# Altium schematic sheet AD8065_circuit.SchDoc
size A4; SheetNumber: 1; SheetTotal: 1
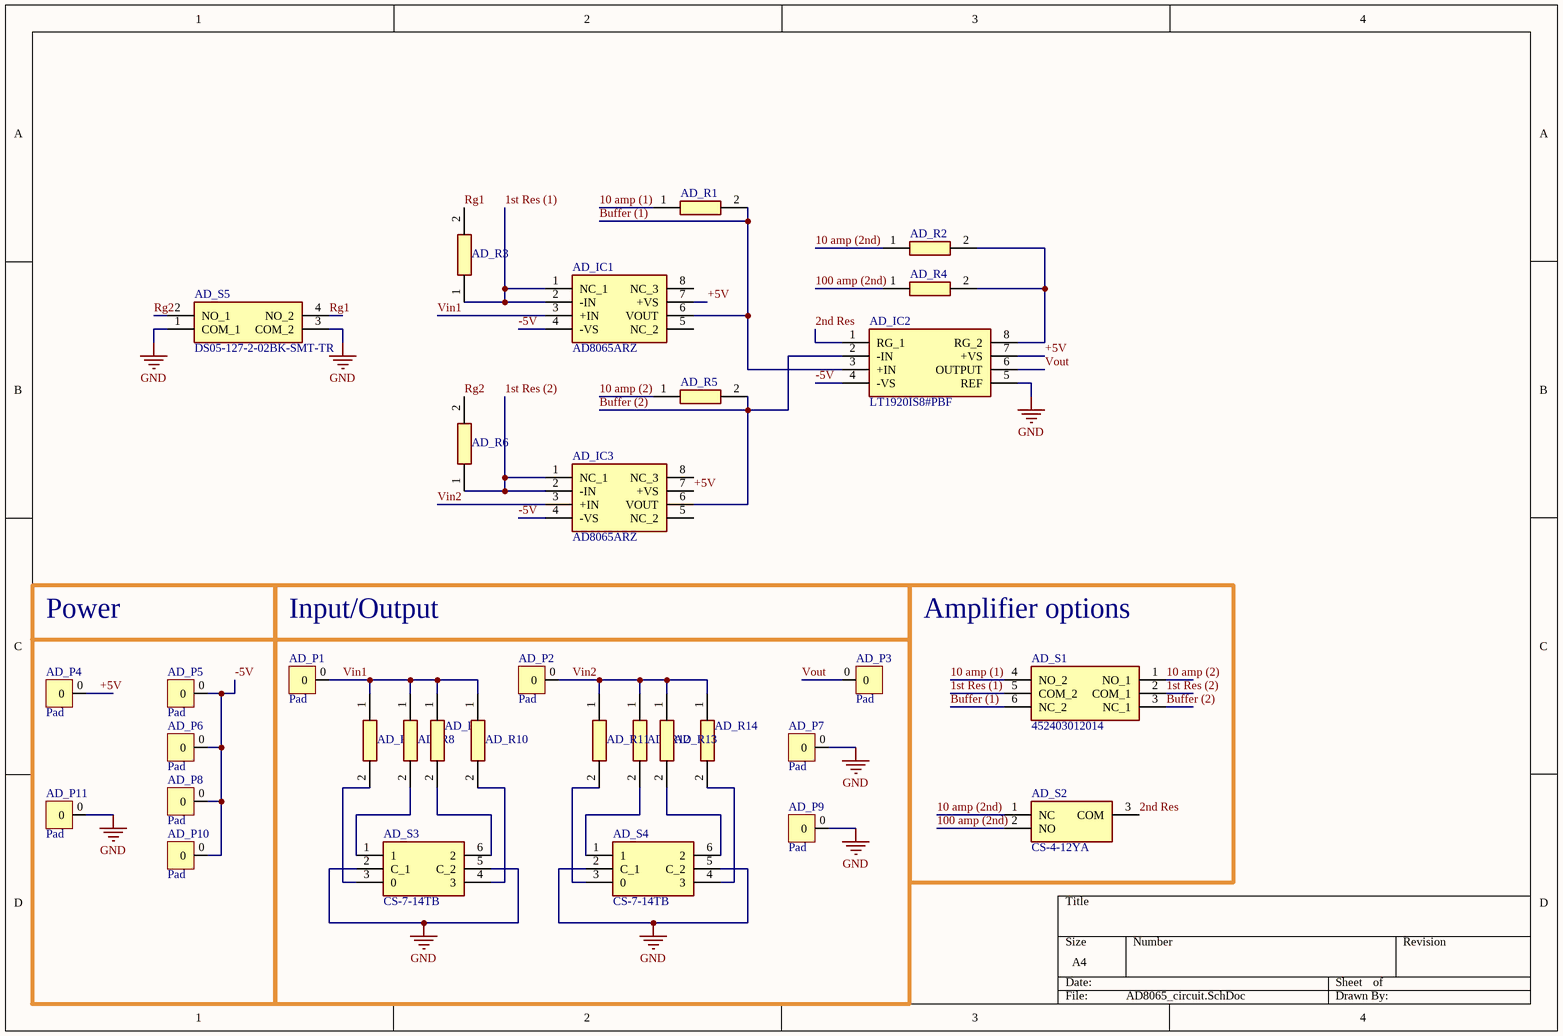
[diagram p0: AD8065_circuit.SchDoc]

## Parts
AD_IC1  AD8065ARZ  [SOIC127P600X175-8N]
AD_IC2  LT1920IS8#PBF  [SOIC127P599X175-8N]
AD_IC3  AD8065ARZ  [SOIC127P600X175-8N]
AD_P1  Pad  [Pad]
AD_P2  Pad  [Pad]
AD_P3  Pad  [Pad]
AD_P4  Pad  [Pad]
AD_P5  Pad  [Pad]
AD_P6  Pad  [Pad]
AD_P7  Pad  [Pad]
AD_P8  Pad  [Pad]
AD_P9  Pad  [Pad]
AD_P10  Pad  [Pad]
AD_P11  Pad  [Pad]
AD_R1  CRG0805F270R  [RESC2012X65N]  (value not drawn)
AD_R2  CRG0805F4K7  [RESC2012X65N]  (value not drawn)
AD_R3  ERJ-HP6F20R0V  [ERJHP6D1000V]  (value not drawn)
AD_R4  CRG0805F330R  [RESC2012X65N]  (value not drawn)
AD_R5  CRG0805F270R  [RESC2012X65N]  (value not drawn)
AD_R6  ERJ-HP6F20R0V  [ERJHP6D1000V]  (value not drawn)
AD_R7  RH73X2A10GNTN  [RESC2013X50N]  (value not drawn)
AD_R8  RH73X2A50GNTN  [RESC2013X50N]  (value not drawn)
AD_R9  RH73H2A100MKTN  [RESC2013X50N]  (value not drawn)
AD_R10  RH73W2A1GNTN  [RESC2013X50N]  (value not drawn)
AD_R11  RH73X2A50GNTN  [RESC2013X50N]  (value not drawn)
AD_R12  RH73X2A10GNTN  [RESC2013X50N]  (value not drawn)
AD_R13  RH73W2A1GNTN  [RESC2013X50N]  (value not drawn)
AD_R14  RH73H2A100MKTN  [RESC2013X50N]  (value not drawn)
AD_S1  452403012014  [452403012014]
AD_S2  CS-4-12YA  [CS412YA]
AD_S3  CS-7-14TB  [SOP254P1000X405-6N]
AD_S4  CS-7-14TB  [SOP254P1000X405-6N]
AD_S5  DS05-127-2-02BK-SMT-TR  [DS05127202BKSMTTR]

## Blocks framed on the sheet
Power: AD_P4-AD_P6 AD_P8 AD_P10 AD_P11
Input/Output: AD_P1-AD_P3 AD_P7 AD_P9 AD_R7-AD_R14 AD_S3 AD_S4
Amplifier options: AD_S1 AD_S2

## Nets
GND: AD_IC2.5(REF) AD_P7.0 AD_P9.0 AD_P11.0 AD_S3.2(C_1) AD_S3.5(C_2) AD_S4.2(C_1) AD_S4.5(C_2) AD_S5.1(COM_1) AD_S5.3(COM_2)
1st Res (1): AD_IC1.1(NC_1) AD_IC1.2(-IN) AD_R3.1 AD_S1.5(COM_2)
1st Res (2): AD_IC3.1(NC_1) AD_IC3.2(-IN) AD_R6.1 AD_S1.2(COM_1)
2nd Res: AD_IC2.1(RG_1) AD_S2.3(COM)
10 amp (1): AD_R1.1 AD_S1.4(NO_2)
10 amp (2): AD_R5.1 AD_S1.1(NO_1)
10 amp (2nd): AD_R2.1 AD_S2.1(NC)
100 amp (2nd): AD_R4.1 AD_S2.2(NO)
+5V: AD_IC1.7(+VS) AD_IC2.7(+VS) AD_IC3.7(+VS) AD_P4.0
-5V: AD_IC1.4(-VS) AD_IC2.4(-VS) AD_IC3.4(-VS) AD_P5.0 AD_P6.0 AD_P8.0 AD_P10.0
Buffer (1): AD_IC1.6(VOUT) AD_IC2.3(+IN) AD_R1.2 AD_S1.6(NC_2)
Buffer (2): AD_IC2.2(-IN) AD_IC3.6(VOUT) AD_R5.2 AD_S1.3(NC_1)
Rg1: AD_R3.2 AD_S5.4(NO_2)
Rg2: AD_R6.2 AD_S5.2(NO_1)
Vin1: AD_IC1.3(+IN) AD_P1.0 AD_R7.1 AD_R8.1 AD_R9.1 AD_R10.1
Vin2: AD_IC3.3(+IN) AD_P2.0 AD_R11.1 AD_R12.1 AD_R13.1 AD_R14.1
Vout: AD_IC2.6(OUTPUT) AD_P3.0
NetAD_IC2_8: AD_IC2.8(RG_2) AD_R2.2 AD_R4.2
NetAD_R7_2: AD_R7.2 AD_S3.3(0)
NetAD_R8_2: AD_R8.2 AD_S3.1
NetAD_R9_2: AD_R9.2 AD_S3.6(2)
NetAD_R10_2: AD_R10.2 AD_S3.4(3)
NetAD_R11_2: AD_R11.2 AD_S4.3(0)
NetAD_R12_2: AD_R12.2 AD_S4.1
NetAD_R13_2: AD_R13.2 AD_S4.6(2)
NetAD_R14_2: AD_R14.2 AD_S4.4(3)

Not connected (* = marked no-connect by the designer): AD_IC1 5(NC_2) 8(NC_3); AD_IC3 5(NC_2) 8(NC_3)

## Library data of the parts
AD_IC1 AD_IC3 = AD8065ARZ: Integrated Circuit; Manufacturer_Name: Analog Devices; Datasheet Link: https://datasheet.datasheetarchive.com/originals/distributors/Datasheets-1/DSA-2047.pdf; Height: 1.75mm; Manufacturer_Part_Number: AD8065ARZ; Mouser Part Number: 584-AD8065ARZ; Mouser Price/Stock: https://www.mouser.co.uk/ProductDetail/Analog-Devices/AD8065ARZ?qs=%2FtpEQrCGXCyXd34RglYLzQ%3D%3D; Arrow Part Number: AD8065ARZ; Arrow Price/Stock: https://www.arrow.com/en/products/ad8065arz/analog-devices?region=nac; Case: SOIC-8; Mounting Style: SMD/SMT
AD_IC2 = LT1920IS8#PBF: Integrated Circuit; Manufacturer_Name: Analog Devices; Datasheet Link: https://datasheet.datasheetarchive.com/originals/distributors/SFDatasheet-4/sf-00091026.pdf; Height: 1.752mm; Manufacturer_Part_Number: LT1920IS8#PBF; Mouser Part Number: 584-LT1920IS8#PBF; Mouser Price/Stock: https://www.mouser.co.uk/ProductDetail/Analog-Devices/LT1920IS8PBF?qs=ytflclh7QUWOSod6PqfjSg%3D%3D; Arrow Part Number: LT1920IS8#PBF; Arrow Price/Stock: https://www.arrow.com/en/products/lt1920is8pbf/analog-devices?region=nac; Case: SOIC-8; Mounting Style: SMD/SMT
AD_R1 AD_R5 = CRG0805F270R: Resistor 270; Manufacturer_Name: TE Connectivity; Datasheet Link: http://www.te.com/commerce/DocumentDelivery/DDEController?Action=showdoc&DocId=Customer+Drawing%7F1623109%7FBA%7Fpdf%7FEnglish%7FENG_CD_1623109_BA.pdf%7F1623109-1; Height: 0.65mm; Manufacturer_Part_Number: CRG0805F270R; Mouser Part Number: 279-CRG0805F270R; Mouser Price/Stock: https://www.mouser.com/Search/Refine.aspx?Keyword=279-CRG0805F270R; Arrow Part Number: CRG0805F270R; Arrow Price/Stock: https://www.arrow.com/en/products/crg0805f270r/te-connectivity; Case: 0805 (in); Mounting Style: SMD/SMT
AD_R2 = CRG0805F4K7: Resistor 4.7k; Manufacturer_Name: TE Connectivity; Datasheet Link: http://www.te.com/commerce/DocumentDelivery/DDEController?Action=showdoc&DocId=Customer+Drawing%7F1623109%7FBA%7Fpdf%7FEnglish%7FENG_CD_1623109_BA.pdf%7F1623109-1; Height: 0.65mm; Manufacturer_Part_Number: CRG0805F4K7; Mouser Part Number: 279-CRG0805F4K7; Mouser Price/Stock: https://www.mouser.co.uk/ProductDetail/TE-Connectivity-Holsworthy/CRG0805F4K7?qs=VHcS2MTj4gYTCl8bEMP1DQ%3D%3D; Arrow Part Number: CRG0805F4K7; Arrow Price/Stock: https://www.arrow.com/en/products/crg0805f4k7/te-connectivity?region=nac; Case: 0805 (in); Mounting Style: SMD/SMT
AD_R3 AD_R6 = ERJ-HP6F20R0V: Resistor 20; Manufacturer_Name: Panasonic; Datasheet Link: http://industrial.panasonic.com/cdbs/www-data/pdf/RDQ0000/ast-ind-151033.pdf; Height: 0.7mm; Manufacturer_Part_Number: ERJ-HP6F20R0V
AD_R4 = CRG0805F330R: Resistor 330; Manufacturer_Name: TE Connectivity; Datasheet Link: http://www.te.com/commerce/DocumentDelivery/DDEController?Action=showdoc&DocId=Customer+Drawing%7F1623109%7FBA%7Fpdf%7FEnglish%7FENG_CD_1623109_BA.pdf%7F1623109-1; Height: 0.65mm; Manufacturer_Part_Number: CRG0805F330R; Mouser Part Number: 279-CRG0805F330R; Mouser Price/Stock: https://www.mouser.co.uk/ProductDetail/TE-Connectivity-Holsworthy/CRG0805F330R?qs=VHcS2MTj4gbLzLJ0%2FI3gmA%3D%3D; Arrow Part Number: CRG0805F330R; Arrow Price/Stock: https://www.arrow.com/en/products/crg0805f330r/te-connectivity?region=nac; Case: 0805 (in); Mounting Style: SMD/SMT
AD_R7 AD_R12 = RH73X2A10GNTN: Resistor 10G; Manufacturer_Name: TE Connectivity; Datasheet Link: https://ms.componentsearchengine.com/Datasheets/2/RH73X2A10GNTN.pdf; Height: 0.5mm; Manufacturer_Part_Number: RH73X2A10GNTN; Mouser Part Number: 279-RH73X2A10GNTN; Mouser Price/Stock: https://www.mouser.co.uk/ProductDetail/TE-Connectivity-Holsworthy/RH73X2A10GNTN?qs=ip69W3eHERU7YDrLGqSvdQ%3D%3D; Arrow Part Number: RH73X2A10GNTN; Arrow Price/Stock: https://www.arrow.com/en/products/rh73x2a10gntn/te-connectivity?region=nac; Case: 0805 (in); Mounting Style: SMD/SMT
AD_R8 AD_R11 = RH73X2A50GNTN: Resistor 50G; Manufacturer_Name: TE Connectivity; Datasheet Link: http://www.te.com/commerce/DocumentDelivery/DDEController?Action=showdoc&DocId=Data+Sheet%7F1773268%7FA%7Fpdf%7FEnglish%7FENG_DS_1773268_A.pdf%7F1625862-4; Height: 0.5mm; Manufacturer_Part_Number: RH73X2A50GNTN; Mouser Part Number: 279-RH73X2A50GNTN; Mouser Price/Stock: https://www.mouser.co.uk/ProductDetail/TE-Connectivity-Holsworthy/RH73X2A50GNTN?qs=ip69W3eHERVWqEnkYPnkdA%3D%3D; Case: 0805 (in); Mounting Style: SMD/SMT
AD_R9 AD_R14 = RH73H2A100MKTN: Resistor 100M; Manufacturer_Name: TE Connectivity; Datasheet Link: http://www.te.com/commerce/DocumentDelivery/DDEController?Action=showdoc&DocId=Data+Sheet%7F1773268%7FA%7Fpdf%7FEnglish%7FENG_DS_1773268_A.pdf%7F1625856-2; Height: 0.5mm; Manufacturer_Part_Number: RH73H2A100MKTN; Mouser Part Number: 279-RH73H2A100MKTN; Mouser Price/Stock: https://www.mouser.co.uk/ProductDetail/TE-Connectivity-Holsworthy/RH73H2A100MKTN?qs=ip69W3eHERW4mrE8f49Fxw%3D%3D; Arrow Part Number: RH73H2A100MKTN; Arrow Price/Stock: https://www.arrow.com/en/products/rh73h2a100mktn/te-connectivity?region=nac; Case: 0805 (in); Mounting Style: SMD/SMT
AD_R10 AD_R13 = RH73W2A1GNTN: Resistor 1G; Manufacturer_Name: TE Connectivity; Datasheet Link: https://componentsearchengine.com/Datasheets/2/RH73W2A1GNTN.pdf; Height: 0.5mm; Manufacturer_Part_Number: RH73W2A1GNTN; Mouser Part Number: 279-RH73W2A1GNTN; Mouser Price/Stock: https://www.mouser.co.uk/ProductDetail/TE-Connectivity-Holsworthy/RH73W2A1GNTN?qs=ip69W3eHERV4S8tLXHYflA%3D%3D; Arrow Part Number: RH73W2A1GNTN; Arrow Price/Stock: https://www.arrow.com/en/products/rh73w2a1gntn/te-connectivity?region=nac; Case: 0805 (in); Mounting Style: SMD/SMT
AD_S1 = 452403012014: Switch; Manufacturer_Name: Wurth Elektronik; Datasheet Link: https://katalog.we-online.de/em/datasheet/452403012014.pdf; Height: 3.3mm; Manufacturer_Part_Number: 452403012014; Mouser Part Number: 710-452403012014; Mouser Price/Stock: https://www.mouser.co.uk/ProductDetail/Wurth-Elektronik/452403012014?qs=DvsTirrhYfOi0QxHyAEO3w%3D%3D
AD_S2 = CS-4-12YA: Switch; Manufacturer_Name: NIDEC COPAL; Datasheet Link: https://www.nidec-copal-electronics.com/j/product/detail/00000197/; Height: 2.6mm; Manufacturer_Part_Number: CS-4-12YA; Mounting Style: SMD/SMT
AD_S3 AD_S4 = CS-7-14TB: Switch; Manufacturer_Name: Copal Electronics; Datasheet Link: https://www.nidec-copal-electronics.com/e/catalog/switch/cs-7.pdf; Height: 4.05mm; Manufacturer_Part_Number: CS-7-14TB; Mounting Style: SMD/SMT
AD_S5 = DS05-127-2-02BK-SMT-TR: Switch; Manufacturer_Name: CUI Devices; Datasheet Link: https://www.cuidevices.com/product/resource/digikeypdf/ds05-127-smt.pdf; Height: 2.6mm; Manufacturer_Part_Number: DS05-127-2-02BK-SMT-TR; Mouser Part Number: 490-DS05127202BK-STR; Mouser Price/Stock: https://www.mouser.co.uk/ProductDetail/CUI-Devices/DS05-127-2-02BK-SMT-TR?qs=wnTfsH77Xs6TIyf6yhikhg%3D%3D; Mounting Style: SMD/SMT